# EAGLE design ms1 (EAGLE 6.5.0)

## Sheet 1 of 2: Power
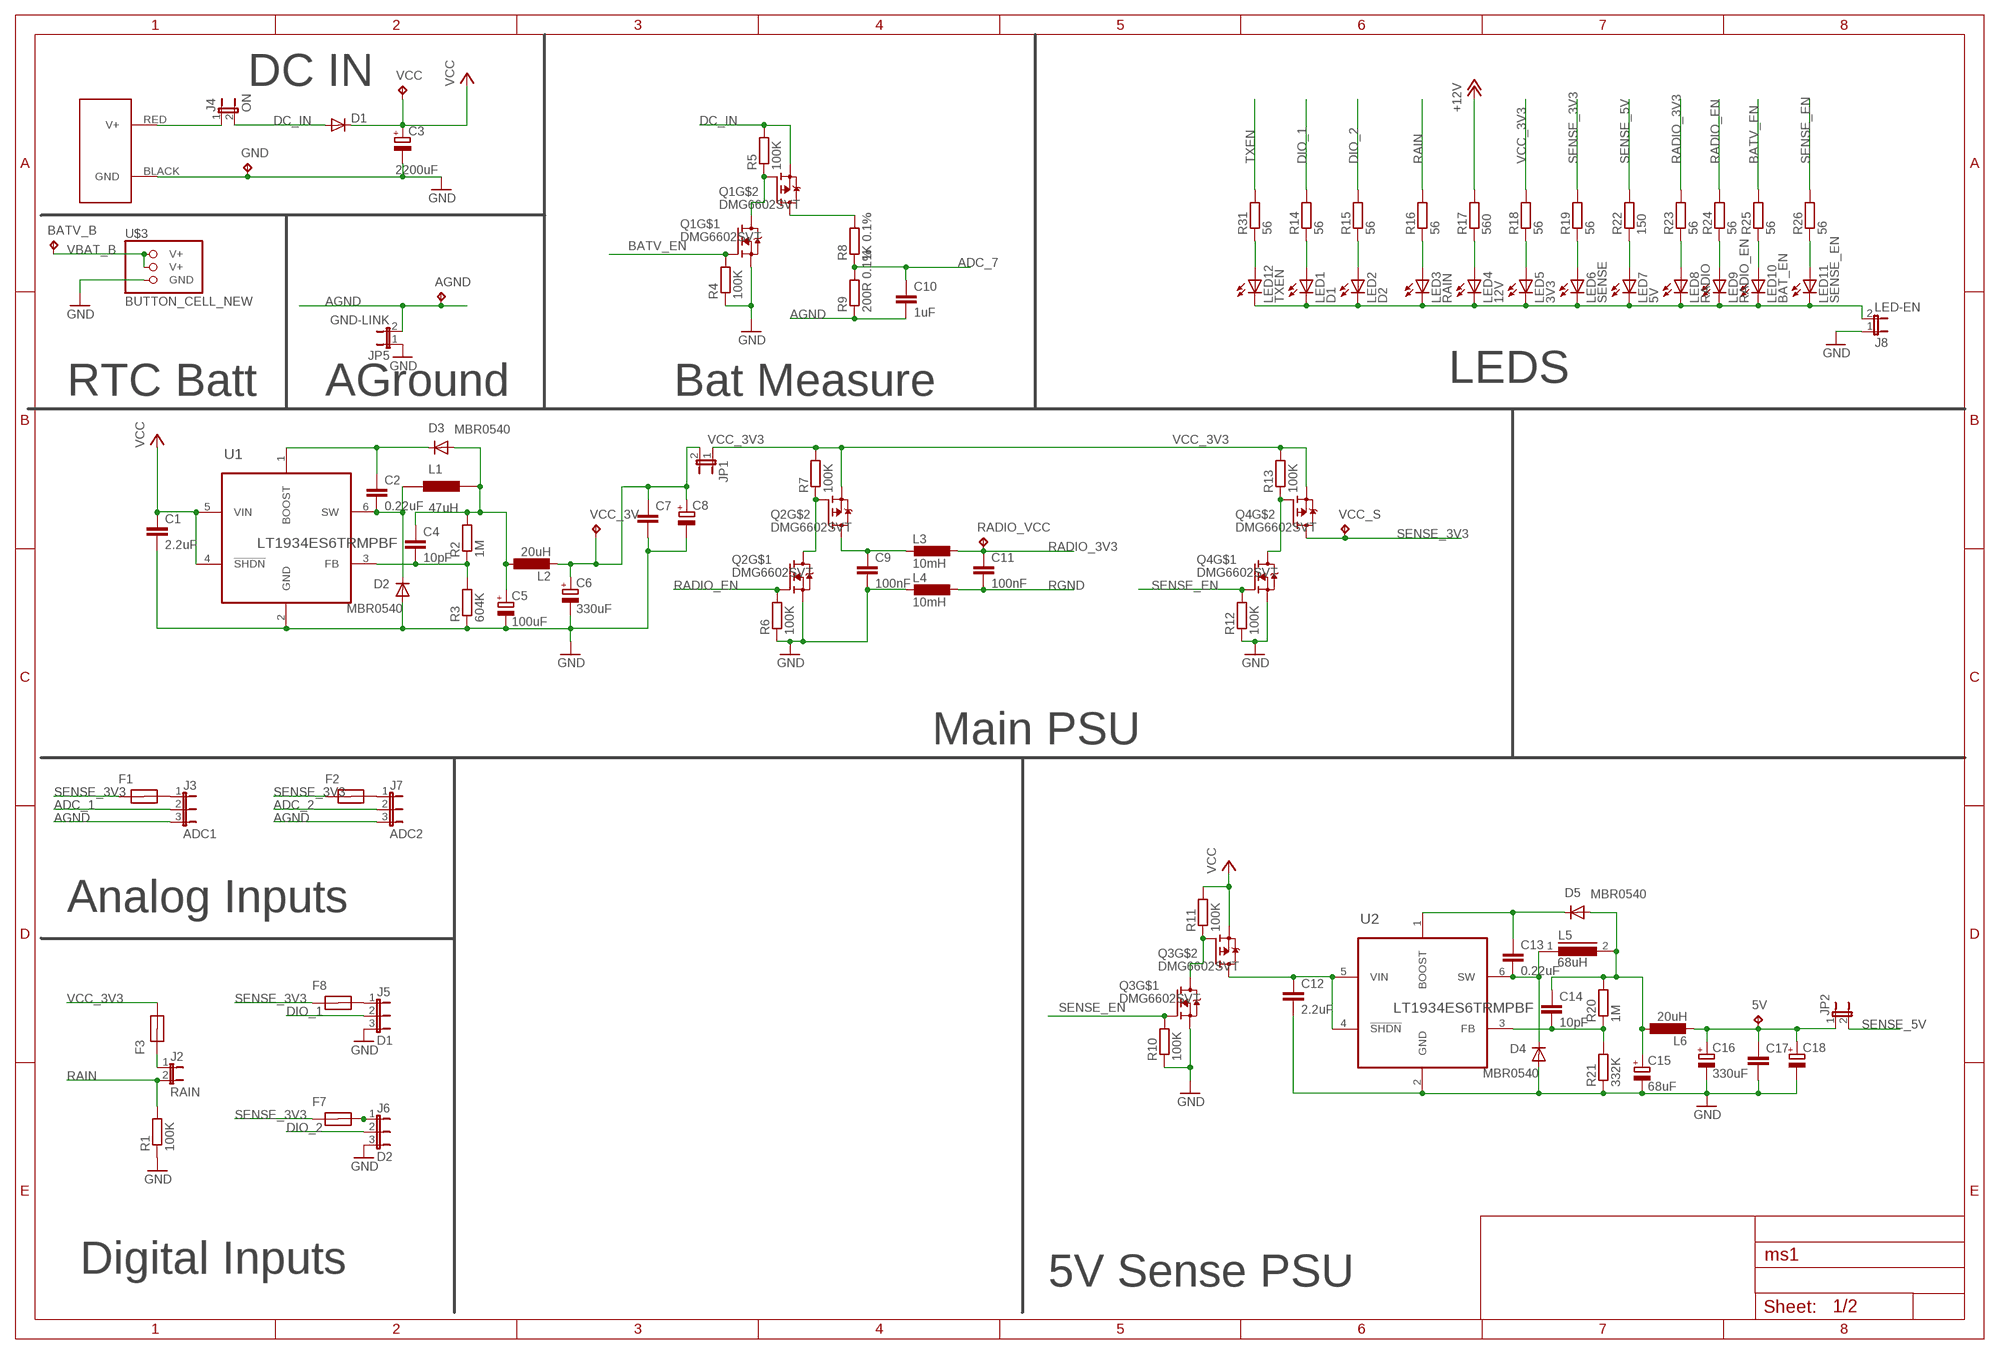
[diagram p0: schematic, sheet 1]

### Parts
5V  5V B  TPB2,54  [B2,54]
AGND  TPB2,54  [B2,54]
BATV_B  5V B  TPB2,54  [B2,54]
C1  2.2uF  C-EUC0805  [C0805]
C2  0.22uF  C-EUC0805  [C0805]
C3  2200uF  CPOL-EUE5-13  [E5-13]
C4  10pF  C-EUC0805  [C0805]
C5  100uF  CPOL-EUE  [PANASONIC_E]
C6  330uF  CPOL-EUE5-8.5  [E5-8,5]
C7  C-EUC0805  [C0805]
C8  CPOL-EUB/3528-21R  [B/3528-21R]
C9  100nF  C-EUC0805  [C0805]
C10  1uF  C-EUC0805  [C0805]
C11  100nF  C-EUC0805  [C0805]
C12  2.2uF  C-EUC0805  [C0805]
C13  0.22uF  C-EUC0805  [C0805]
C14  10pF  C-EUC0805  [C0805]
C15  68uF  CPOL-EUE  [PANASONIC_E]
C16  330uF  CPOL-EUE5-8.5  [E5-8,5]
C17  C-EUC0805  [C0805]
C18  CPOL-EUB/3528-21R  [B/3528-21R]
D1  DIODE-SMB  [SMB]
D2  MBR0540  MBR0520LT  [SOD123]
D3  MBR0540  MBR0520LT  [SOD123]
D4  MBR0540  MBR0520LT  [SOD123]
D5  MBR0540  MBR0520LT  [SOD123]
F1  MCF0805  [0805]
F2  MCF0805  [0805]
F3  MCF0805  [0805]
F7  MCF0805  [0805]
F8  MCF0805  [0805]
GND  5V B  TPB2,54  [B2,54]
J1  POWERPOLE_POWER25A  [POWERPOLE_PAIR_25A]
J2  RAIN  2-PIN-MOLEX  [2-MOLEX]
J3  ADC1  3-PIN-MOLEX  [3-MOLEX]
J4  ON  2-PIN-MOLEX  [2-MOLEX]
J5  D1  3-PIN-MOLEX  [3-MOLEX]
J6  D2  3-PIN-MOLEX  [3-MOLEX]
J7  ADC2  3-PIN-MOLEX  [3-MOLEX]
J8  LED-EN  2-PIN-MOLEX  [2-MOLEX]
JP1  JUMPER-2SMD-NO  [SJ_2S-NO]
JP2  JUMPER-2SMD-NO  [SJ_2S-NO]
JP5  GND-LINK  JP1E  [JP1]
L1  47uH  SRU1048  [1048]
L2  20uH  L-EU6000-XXX-RC  [6000-XXXX-RC]
L3  10mH  L-EUL3230M  [L3230M]
L4  10mH  L-EUL3230M  [L3230M]
L5  68uH  DR127  [DR127]
L6  20uH  L-EU6000-XXX-RC  [6000-XXXX-RC]
LED1  D1  LEDCHIP-LED0805  [CHIP-LED0805]
LED2  D2  LEDCHIP-LED0805  [CHIP-LED0805]
LED3  RAIN  LEDCHIP-LED0805  [CHIP-LED0805]
LED4  12V  LEDCHIP-LED0805  [CHIP-LED0805]
LED5  3V3  LEDCHIP-LED0805  [CHIP-LED0805]
LED6  SENSE  LEDCHIP-LED0805  [CHIP-LED0805]
LED7  5V  LEDCHIP-LED0805  [CHIP-LED0805]
LED8  RADIO  LEDCHIP-LED0805  [CHIP-LED0805]
LED9  RADIO_EN  LEDCHIP-LED0805  [CHIP-LED0805]
LED10  BAT_EN  LEDCHIP-LED0805  [CHIP-LED0805]
LED11  SENSE_EN  LEDCHIP-LED0805  [CHIP-LED0805]
LED12  TXEN  LEDCHIP-LED0805  [CHIP-LED0805]
Q1  DMG6602SVT  [TSOT26]
Q2  DMG6602SVT  [TSOT26]
Q3  DMG6602SVT  [TSOT26]
Q4  DMG6602SVT  [TSOT26]
R1  100K  R-EU_R0805  [R0805]
R2  1M  R-EU_R0805  [R0805]
R3  604K  R-EU_R0805  [R0805]
R4  100K  R-EU_R0805  [R0805]
R5  100K  R-EU_R0805  [R0805]
R6  100K  R-EU_R0805  [R0805]
R7  100K  R-EU_R0805  [R0805]
R8  1K 0.1%  R-EU_R0805  [R0805]
R9  200R 0.1%  R-EU_R0805  [R0805]
R10  100K  R-EU_R0805  [R0805]
R11  100K  R-EU_R0805  [R0805]
R12  100K  R-EU_R0805  [R0805]
R13  100K  R-EU_R0805  [R0805]
R14  56  R-EU_R0805  [R0805]
R15  56  R-EU_R0805  [R0805]
R16  56  R-EU_R0805  [R0805]
R17  560  R-EU_R0805  [R0805]
R18  56  R-EU_R0805  [R0805]
R19  56  R-EU_R0805  [R0805]
R20  1M  R-EU_R0805  [R0805]
R21  332K  R-EU_R0805  [R0805]
R22  150  R-EU_R0805  [R0805]
R23  56  R-EU_R0805  [R0805]
R24  56  R-EU_R0805  [R0805]
R25  56  R-EU_R0805  [R0805]
R26  56  R-EU_R0805  [R0805]
R31  56  R-EU_R0805  [R0805]
RADIO_VCC  TPB2,54  [B2,54]
U1  LT1934ES6TRMPBF  [SOT95P280X100-6N]
U2  LT1934ES6TRMPBF  [SOT95P280X100-6N]
U$3  BUTTON_CELL_NEW  [CR2016]
VCC  TPB2,54  [B2,54]
VCC_3V  TPB2,54  [B2,54]
VCC_S  TPB2,54  [B2,54]

### Nets
ADC_1: J3.2 ; also sheet 2
ADC_2: J7.2 ; also sheet 2
ADC_7: C10.1 R8.1 R9.2 ; also sheet 2
AGND: AGND.TP C10.2 J3.3 J7.3 JP5.2 R9.1 ; also sheet 2
BATV_EN: Q1.P$1(G) R4.2 R25.2 ; also sheet 2
DC_IN: D1.A J4.2 Q1.P$2(S) R5.2
DIO_1: J5.2 R14.2 ; also sheet 2
DIO_2: J6.2 R15.2 ; also sheet 2
GND: C1.2 C3.- C5.- C6.- C7.2 C8.- C9.2 C12.2 C15.- C16.- C17.2 C18.- D2.A D4.A GND.TP J1.BLACK(GND) J5.3 J6.3 J8.1 JP5.1 L4.2 Q1.P$5(S) Q2.P$5(S) Q3.P$5(S) Q4.P$5(S) R1.1 R3.1 R4.1 R6.1 R10.1 R12.1 R21.1 U1.2(GND) U2.2(GND) U$3.GND ; also sheet 2
LGND: J8.2 LED1.C LED2.C LED3.C LED4.C LED5.C LED6.C LED7.C LED8.C LED9.C LED10.C LED11.C LED12.C
N$1: J1.RED(V+) J4.1
N$2: LED4.A R17.1
N$3: C13.2 D4.C L5.1 U2.6(SW)
N$4: C13.1 D5.C U2.1(BOOST)
N$5: C14.2 R20.1 R21.2 U2.3(FB)
N$6: C14.1 C15.+ D5.A L5.2 L6.1 R20.2
N$7: Q2.P$3(G) Q2.P$6(D) R7.1
N$12: Q1.P$3(G) Q1.P$6(D) R5.1
N$13: C6.+ C7.1 C8.+ JP1.2 L2.2 VCC_3V.TP
N$14: 5V.TP C16.+ C17.1 C18.+ JP2.1 L6.2
N$15: LED9.A R24.1
N$16: LED3.A R16.1
N$18: F1.2 J3.1
N$19: F2.2 J7.1
N$20: LED2.A R15.1
N$21: F7.2 J6.1
N$22: F8.2 J5.1
N$23: LED1.A R14.1
N$24: C9.1 L3.2 Q2.P$4(D)
N$25: Q3.P$3(G) Q3.P$6(D) R11.1
N$26: F3.1 J2.1
N$27: LED12.A R31.1
N$50: LED10.A R25.1
N$51: LED11.A R26.1
N$70: Q4.P$3(G) Q4.P$6(D) R13.1
N$78: C2.2 D2.C L1.1 U1.6(SW)
N$107: C4.1 C5.+ D3.A L1.2 L2.1 R2.2
N$108: LED8.A R23.1
N$109: LED7.A R22.1
N$110: LED6.A R19.1
N$111: LED5.A R18.1
N$117: C2.1 D3.C U1.1(BOOST)
N$118: C4.2 R2.1 R3.2 U1.3(FB)
RADIO_3V3: C11.1 L3.1 R23.2 RADIO_VCC.TP ; also sheet 2
RADIO_EN: Q2.P$1(G) R6.2 R24.2 ; also sheet 2
RAIN: J2.2 R1.2 R16.2 ; also sheet 2
RGND: C11.2 L4.1 ; also sheet 2
SENSE_3V3: F1.1 F2.1 F7.1 F8.1 Q4.P$4(D) R19.2 VCC_S.TP ; also sheet 2
SENSE_5V: JP2.2 R22.2 ; also sheet 2
SENSE_EN: Q3.P$1(G) Q4.P$1(G) R10.2 R12.2 R26.2 ; also sheet 2
TXEN: R31.2 ; also sheet 2
VBAT_B: BATV_B.TP U$3.V+@1(V+) U$3.V+@2(V+) ; also sheet 2
VCC: C1.1 C3.+ D1.C Q3.P$2(S) R11.2 R17.2 U1.4(!SHDN) U1.5(VIN) VCC.TP ; supply symbol labelled +12V
VCC_3V3: F3.2 JP1.1 Q2.P$2(S) Q4.P$2(S) R7.2 R13.2 R18.2 ; also sheet 2
VCC_HP2_SW: C12.1 Q3.P$4(D) U2.4(!SHDN) U2.5(VIN)
VCC_HP2_SW1: Q1.P$4(D) R8.2

### Notes on the sheet
- DC IN
- RTC Batt | AGround | Bat Measure | LEDS
- Main PSU
- Analog Inputs
- Digital Inputs | 5V Sense PSU

## Sheet 2 of 2: ICs
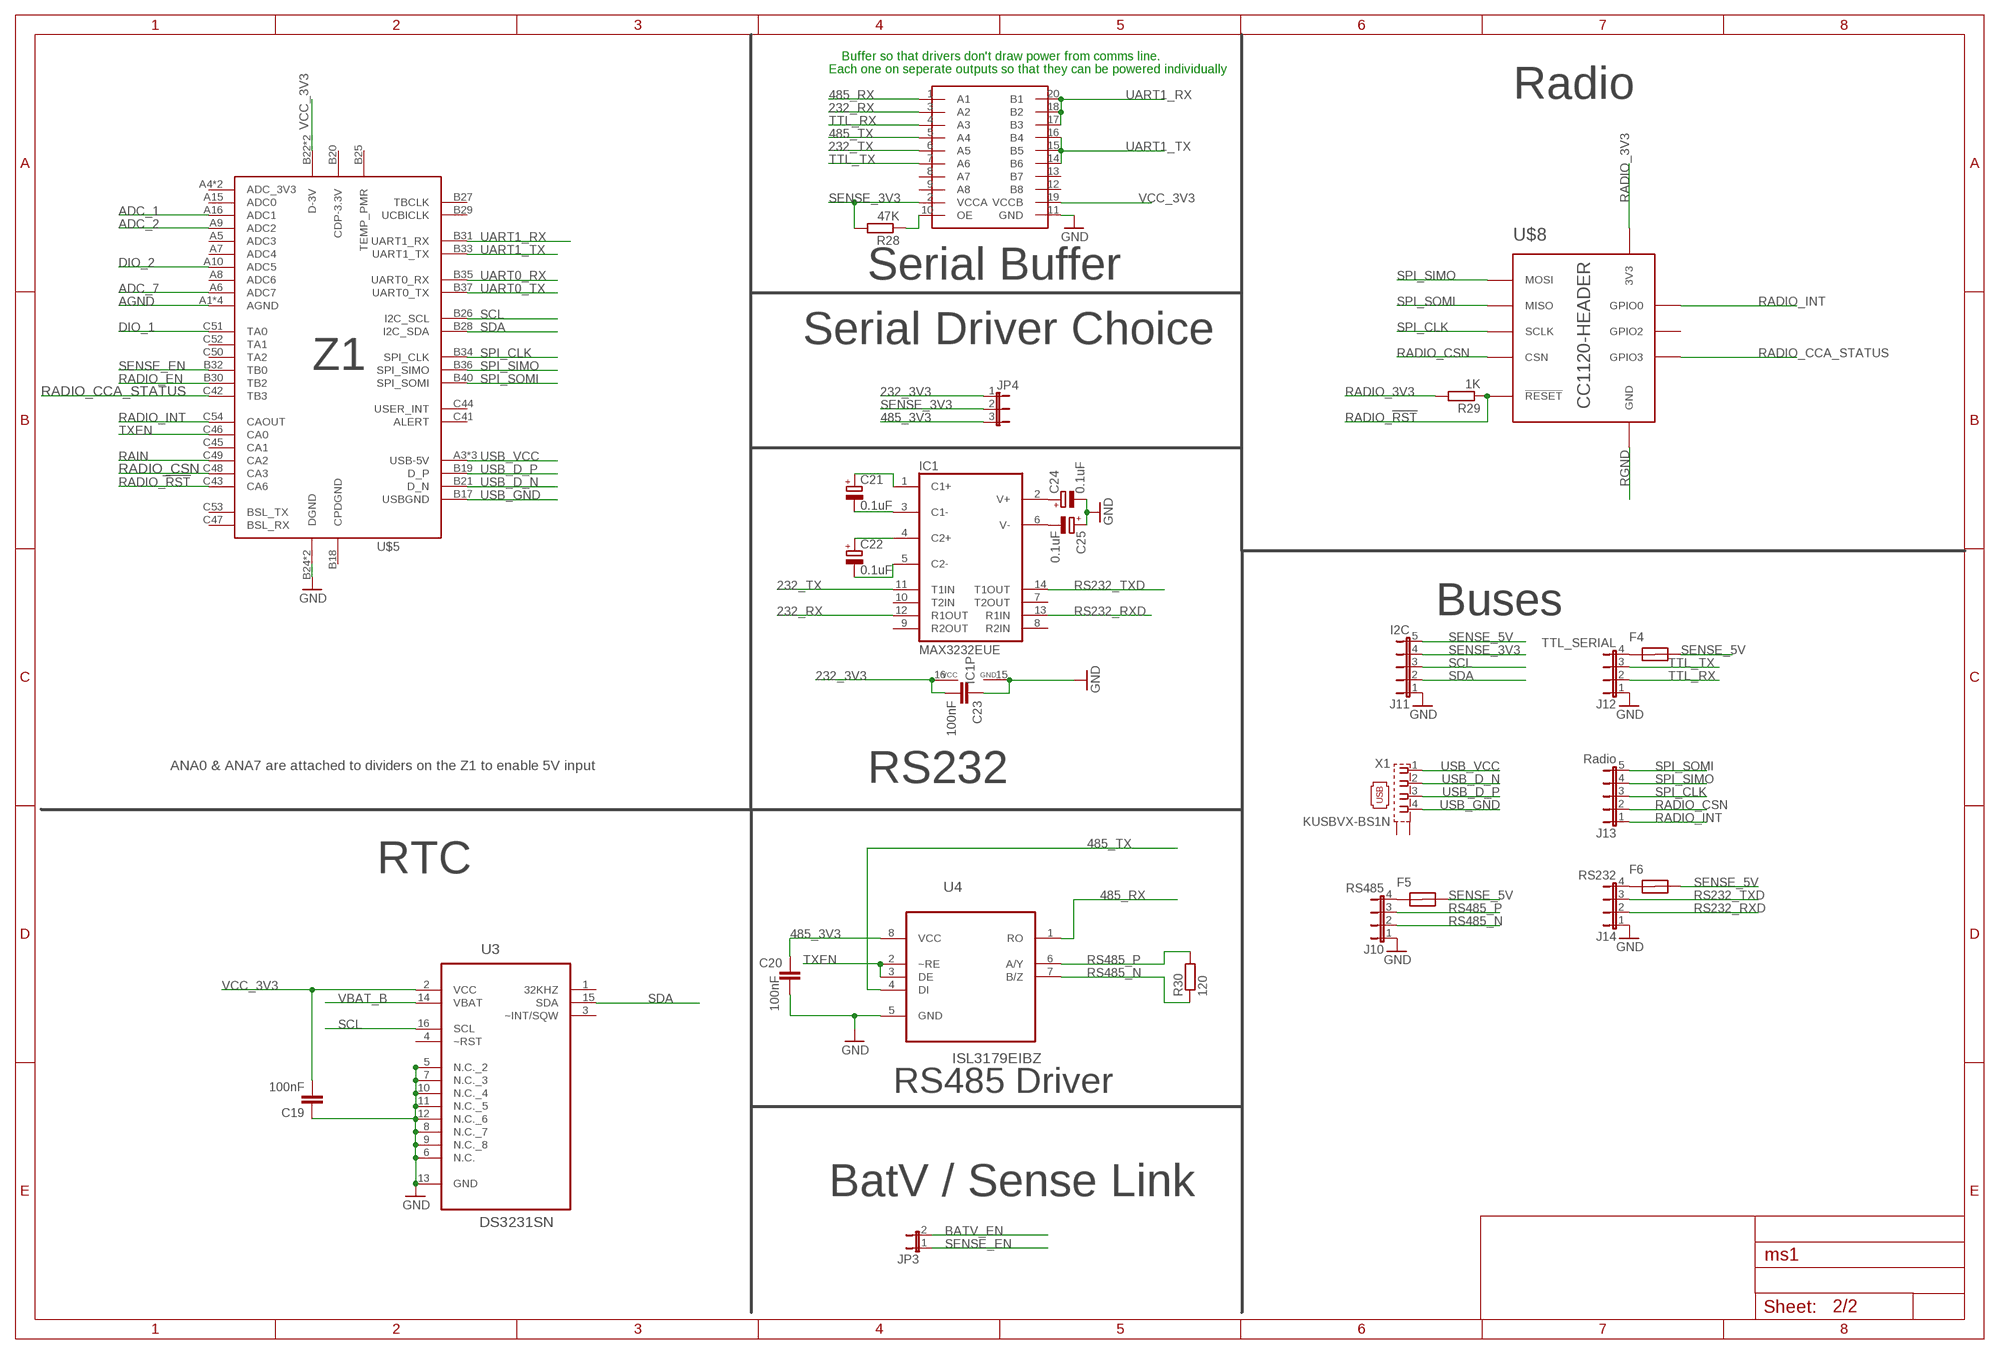
[diagram p1: schematic, sheet 2]

### Parts
C19  100nF  C-EUC0805  [C0805]
C20  100nF  C-EUC0805  [C0805]
C21  0.1uF  CPOL-EUA/3216-18W  [A/3216-18W]
C22  0.1uF  CPOL-EUA/3216-18W  [A/3216-18W]
C23  100nF  C-EUC0805  [C0805]
C24  0.1uF  CPOL-EUA/3216-18W  [A/3216-18W]
C25  0.1uF  CPOL-EUA/3216-18W  [A/3216-18W]
F4  MCF0805  [0805]
F5  MCF0805  [0805]
F6  MCF0805  [0805]
IC1  MAX3232EUE  [TSSOP16]
J10  RS485  4-PIN-MOLEX  [4-MOLEX]
J11  I2C  5-PIN-MOLEX  [5-MOLEX]
J12  TTL_SERIAL  4-PIN-MOLEX  [4-MOLEX]
J13  Radio  5-PIN-MOLEX  [5-MOLEX]
J14  RS232  4-PIN-MOLEX  [4-MOLEX]
JP3  JUMPER-2SMD-NC  [SJ_2S]
JP4  JP2E  [JP2]
R28  47K  R-EU_R0805  [R0805]
R29  1K  R-EU_R0805  [R0805]
R30  120  R-EU_R0805  [R0805]
U3  DS3231SN  [SOIC127P1032X265-16N]
U4  ISL3179EIBZ  [SOIC127P600X175-8N]
U$5  Z1  [Z1]
U$6  TXS0108E  [TSSOP20]
U$8  CC1120-HEADER-SMT  [CC1120-HEADERS-SMT]
X1  KUSBVX-BS1N  [KUSBVX-BS1N]

### Nets
232_3V3: C23.2 IC1.16(VCC) JP4.1
232_RX: IC1.12(R1OUT) U$6.3(A2)
232_TX: IC1.11(T1IN) U$6.6(A5)
485_3V3: C20.1 JP4.3 U4.8(VCC)
485_RX: U4.1(RO) U$6.1(A1)
485_TX: U4.4(DI) U$6.5(A4)
ADC_1: U$5.A16(ADC1) ; also sheet 1
ADC_2: U$5.A9(ADC2) ; also sheet 1
ADC_7: U$5.A6(ADC7) ; also sheet 1
AGND: U$5.A1(AGND) U$5.A2(AGND) U$5.A11(AGND) U$5.A12(AGND) ; also sheet 1
BATV_EN: JP3.2 ; also sheet 1
DIO_1: U$5.C51(TA0) ; also sheet 1
DIO_2: U$5.A10(ADC5) ; also sheet 1
GND: C19.1 C20.2 C23.1 C24.- C25.+ IC1.15(GND) J10.1 J11.1 J12.1 J14.1 U3.5(N.C._2) U3.6(N.C.) U3.7(N.C._3) U3.8(N.C._7) U3.9(N.C._8) U3.10(N.C._4) U3.11(N.C._5) U3.12(N.C._6) U3.13(GND) U4.5(GND) U$5.B24(DGND) U$5.C39(DGND) U$6.11(GND) ; also sheet 1
N$8: R28.1 U$6.10(OE)
N$9: F5.1 J10.4
N$11: F4.1 J12.4
N$17: F6.1 J14.4
N$59: C22.- IC1.5(C2-)
N$80: C22.+ IC1.4(C2+)
N$81: C21.- IC1.3(C1-)
N$85: C21.+ IC1.1(C1+)
N$86: C24.+ IC1.2(V+)
N$87: C25.- IC1.6(V-)
RADIO_3V3: R29.2 U$8.3V3-1(3V3) U$8.3V3-2(3V3) ; also sheet 1
RADIO_!RST: R29.1 U$5.C43(CA6) U$8.RESET(!RESET)
RADIO_CCA_STATUS: U$5.C42(TB3) U$8.GPIO3
RADIO_CSN: J13.2 U$5.C48(CA3) U$8.CSN
RADIO_EN: U$5.B30(TB2) ; also sheet 1
RADIO_INT: J13.1 U$5.C54(CAOUT) U$8.GPIO0
RAIN: U$5.C49(CA2) ; also sheet 1
RGND: U$8.GND U$8.GND1(GND) U$8.GND2(GND) ; also sheet 1
RS232_RXD: IC1.13(R1IN) J14.2
RS232_TXD: IC1.14(T1OUT) J14.3
RS485_N [rs485]: J10.2 R30.1 U4.7(B/Z)
RS485_P [rs485]: J10.3 R30.2 U4.6(A/Y)
SCL: J11.3 U3.16(SCL) U$5.B26(I2C_SCL)
SDA: J11.2 U3.15(SDA) U$5.B28(I2C_SDA)
SENSE_3V3: J11.4 JP4.2 R28.2 U$6.2(VCCA) ; also sheet 1
SENSE_5V: F4.2 F5.2 F6.2 J11.5 ; also sheet 1
SENSE_EN: JP3.1 U$5.B32(TB0) ; also sheet 1
SPI_CLK: J13.3 U$5.B34(SPI_CLK) U$8.SCLK
SPI_SIMO: J13.4 U$5.B36(SPI_SIMO) U$8.MOSI
SPI_SOMI: J13.5 U$5.B40(SPI_SOMI) U$8.MISO
TTL_RX: J12.2 U$6.4(A3)
TTL_TX: J12.3 U$6.7(A6)
TXEN: U4.2(~RE) U4.3(DE) U$5.C46(CA0) ; also sheet 1
UART0_RX: U$5.B35(UART0_RX)
UART0_TX: U$5.B37(UART0_TX)
UART1_RX: U$5.B31(UART1_RX) U$6.17(B3) U$6.18(B2) U$6.20(B1)
UART1_TX: U$5.B33(UART1_TX) U$6.14(B6) U$6.15(B5) U$6.16(B4)
USB_D_N: U$5.B21(D_N) X1.2
USB_D_P: U$5.B19(D_P) X1.3
USB_GND: U$5.B17(USBGND) X1.4
USB_VCC: U$5.A3(USB-5V) U$5.A13(USB-5V) U$5.B23(USB-5V) X1.1
VBAT_B: U3.14(VBAT) ; also sheet 1
VCC_3V3: C19.2 U3.2(VCC) U$5.B22(D-3V) U$5.C40(D-3V) U$6.19(VCCB) ; also sheet 1
Unconnected: IC1.7(T2OUT) IC1.8(R2IN) IC1.9(R2OUT) IC1.10(T2IN) U3.1(32KHZ) U3.3(~INT/SQW) U3.4(~RST) U$5.A5(ADC3) U$5.A7(ADC4) U$5.A8(ADC6) U$5.A15(ADC0) U$5.B18(CPDGND) U$5.B20(CDP-3.3V) U$5.B25(TEMP_PMR) U$5.B27(TBCLK) U$5.B29(UCBICLK) U$5.C41(ALERT) U$5.C44(USER_INT) U$5.C45(CA1) U$5.C47(BSL_RX) U$5.C50(TA2) U$5.C52(TA1) U$5.C53(BSL_TX) U$6.8(A7) U$6.9(A8) U$6.12(B8) U$6.13(B7) U$8.GPIO2 X1.M1(S1) X1.M2(S2)

### Notes on the sheet
- Buffer so that drivers don't draw power from comms line.
- Each one on seperate outputs so that they can be powered individually
- Radio
- Serial Buffer
- Serial Driver Choice
- Buses
- ANA0 & ANA7 are attached to dividers on the Z1 to enable 5V input
- RS232
- RTC
- RS485 Driver
- BatV / Sense Link

## Power pins joined to a net without a drawn wire
ADC_3V3: U$5.A4(ADC_3V3) U$5.A14(ADC_3V3)

## Library data of the parts
5V AGND BATV_B GND RADIO_VCC VCC VCC_3V VCC_S = testpad:TP: Test pad
C1 C2 C4 C7 C9-C14 C17 C19 C23 = resistor:C-EU: CAPACITOR, European symbol
C3 C5 C6 C15 C16 = rcl:CPOL-EU: POLARIZED CAPACITOR, European symbol
C8 C18 C21 C22 C24 C25 = resistor:CPOL-EU: POLARIZED CAPACITOR, European symbol
C20 = glacsweb:C-EU: CAPACITOR, European symbol
D1 = diode:DIODE-: DIODE
D2-D5 = diode:MBR0520LT: SCHOTTKY BARRIER RECTIFIER Source: http://onsemi.com .. MBR0520LT1-D.pdf
F1-F8 = farnell-parts:MCF0805
IC1 = maxim:MAX3232*: True RS-232 Transceivers 3.0V to 5.5V, Low-Power up to 1Mbps, Using Four 0.1µF External Capacitors Source: http://pdfserv.maxim-ic.com/en/ds/MAX3222-MAX3241.pdf; MF: MAXIM; MPN: MAX3232EUE+; OC_FARNELL: 1379769; OC_NEWARK: 68K4632
J1 = powerpoles:POWERPOLE_POWER: Anderson Powerpole Power Connector using ameteur radio standard layout
J2 J4 J8 = farnell-parts:2-PIN-MOLEX
J3 J5-J7 = farnell-parts:3-PIN-MOLEX
J10 J12 J14 = farnell-parts:4-PIN-MOLEX
J11 J13 = farnell-parts:5-PIN-MOLEX
JP1-JP3 = SparkFun-Passives:JUMPER-2: Jumper Basic 0.1" spaced jumper. Use with breakaway headers.
JP4 = jumper:JP2E: JUMPER
JP5 = jumper:JP1E: JUMPER
L1 = farnell-parts:SRU1048
L2 L6 = rcl:L-EU: INDUCTOR, European symbol
L3 L4 = resistor:L-EU: INDUCTOR, European symbol
L5 = inductors:DR127: High Power Density, High Efficiency, Shielded Inductors Source: coiltronics_dr_series.pdf
LED1-LED12 = led:LED: LED OSRAM: - CHIPLED LG R971, LG N971, LY N971, LG Q971, LY Q971, LO R971, LY R971 LH N974, LH R974 LS Q976, LO Q976, LY Q976 LO Q996 - Hyper CHIPLED LW Q18S LB Q993, LB Q99A, LB R99A - SideLED LS A670, LO A670, LY A670, LG A670, LP A670 LB A673, LV A673, LT A673, LW A673 LH A674 LY A675 LS A676, LA A676, LO A676, LY A676, LW A676 LS A679, LY A679, LG A679 - Hyper Micro SIDELED® LS Y876, LA Y876, LO Y876, LY Y876 LT Y87S - SmartLED LW L88C, LW L88S LB L89C, LB L89S, LG L890 LS L89K, LO L89K, LY L89K LS L896, LA L896, LO L896, LY L896 - TOPLED LS T670, LO T670, LY T670, LG T670, LP T670 LSG T670, LSP T670, LSY T670, LOP T670, LYG T670 LG T671, LOG T671, LSG T671 LB T673, LV T673, LT T673, LW T673 LH T674 LS T676, LA T676, LO T676, LY T676, LB T676, LH T676, LSB T676, LW T676 LB T67C, LV T67C, LT T67C, LS T67K, LO T67K, LY T67K, LW E67C LS E67B, LA E67B, LO E67B, LY E67B, LB E67C, LV E67C, LT E67C LW T67C LS T679, LY T679, LG T679 LS T770, LO T770, LY T770, LG T770, LP T770 LB T773, LV T773, LT T773, LW T773 LH T774 LS E675, LA E675, LY E675, LS T675 LS T776, LA T776, LO T776, LY T776, LB T776 LHGB T686 LT T68C, LB T68C - Hyper Mini TOPLED® LB M676 - Mini TOPLED Santana® LG M470 LS M47K, LO M47K, LY M47K Source: http://www.osram.convergy.de LUXEON: - LUMILED® LXK2-PW12-R00, LXK2-PW12-S00, LXK2-PW14-U00, LXK2-PW14-V00 LXK2-PM12-R00, LXK2-PM12-S00, LXK2-PM14-U00 LXK2-PE12-Q00, LXK2-PE12-R00, LXK2-PE12-S00, LXK2-PE14-T00, LXK2-PE14-U00 LXK2-PB12-K00, LXK2-PB12-L00, LXK2-PB12-M00, LXK2-PB14-N00, LXK2-PB14-P00, LXK2-PB14-Q00 LXK2-PR12-L00, LXK2-PR12-M00, LXK2-PR14-Q00, LXK2-PR14-R00 LXK2-PD12-Q00, LXK2-PD12-R00, LXK2-PD12-S00 LXK2-PH12-R00, LXK2-PH12-S00 LXK2-PL12-P00, LXK2-PL12-Q00, LXK2-PL12-R00 Source: www.luxeon.com KINGBRIGHT: KA-3528ASYC Source: www.kingbright.com
Q1-Q4 = farnell-parts:DMG6602SVT
R1-R26 R28-R31 = resistor:R-EU_: RESISTOR, European symbol
U1 U2 = farnell-parts:LT1934ES6TRMPBF; DESCRIPTION: Micropower Step-Down Switching Regulators; MPN: LT1934ES6#TRMPBF; OC_FARNELL: 1663810; OC_NEWARK: 59M8316; PACKAGE: TSOT-23-6; SUPPLIER: Linear Technology
U3 = farnell-parts:DS3231SN: Extremely Accurate I2C-Integrated RTC/TCXO/Crystal; MPN: DS3231SN#; OC_FARNELL: 1593292; OC_NEWARK: 68K3406; PACKAGE: SOIC-16; SUPPLIER: Maxim
U4 = glacsweb:ISL3179EIBZ: TRANCEIVER; MPN: ISL3179EIBZ; OC_FARNELL: 1439860; OC_NEWARK: 58M7513; PACKAGE: SOIC-8; SUPPLIER: Intersil
U$3 = gumsense:BUTTON_CELL_NEW
U$5 = z1:Z1
U$6 = basestation:TXS0108E: Texas Instruments TXS0108E 8-BIT BIDIRECTIONAL VOLTAGE-LEVEL TRANSLATOR FOR OPEN-DRAIN AND PUSH-PULL APPLICATIONS
U$8 = CC11x:CC1120-HEADER; MANUFACTURER: HARWIN; MPN: M50-3601042; OC_FARNEL: CN14037; QTY: 2
X1 = con-kycon:KUSBVX-BS1N: USB B-type Receptacle Vertical, 4 Position, Through Hole Source: Sibalco Kycon KUSBVX-BS1N-xxx.pdf

## Net classes
1 usb: width 0.305 mm, drill 0.356 mm, clearance 0.152 mm
2 rs485: width 0.305 mm, drill 0.356 mm, clearance 0.305 mm

## Board
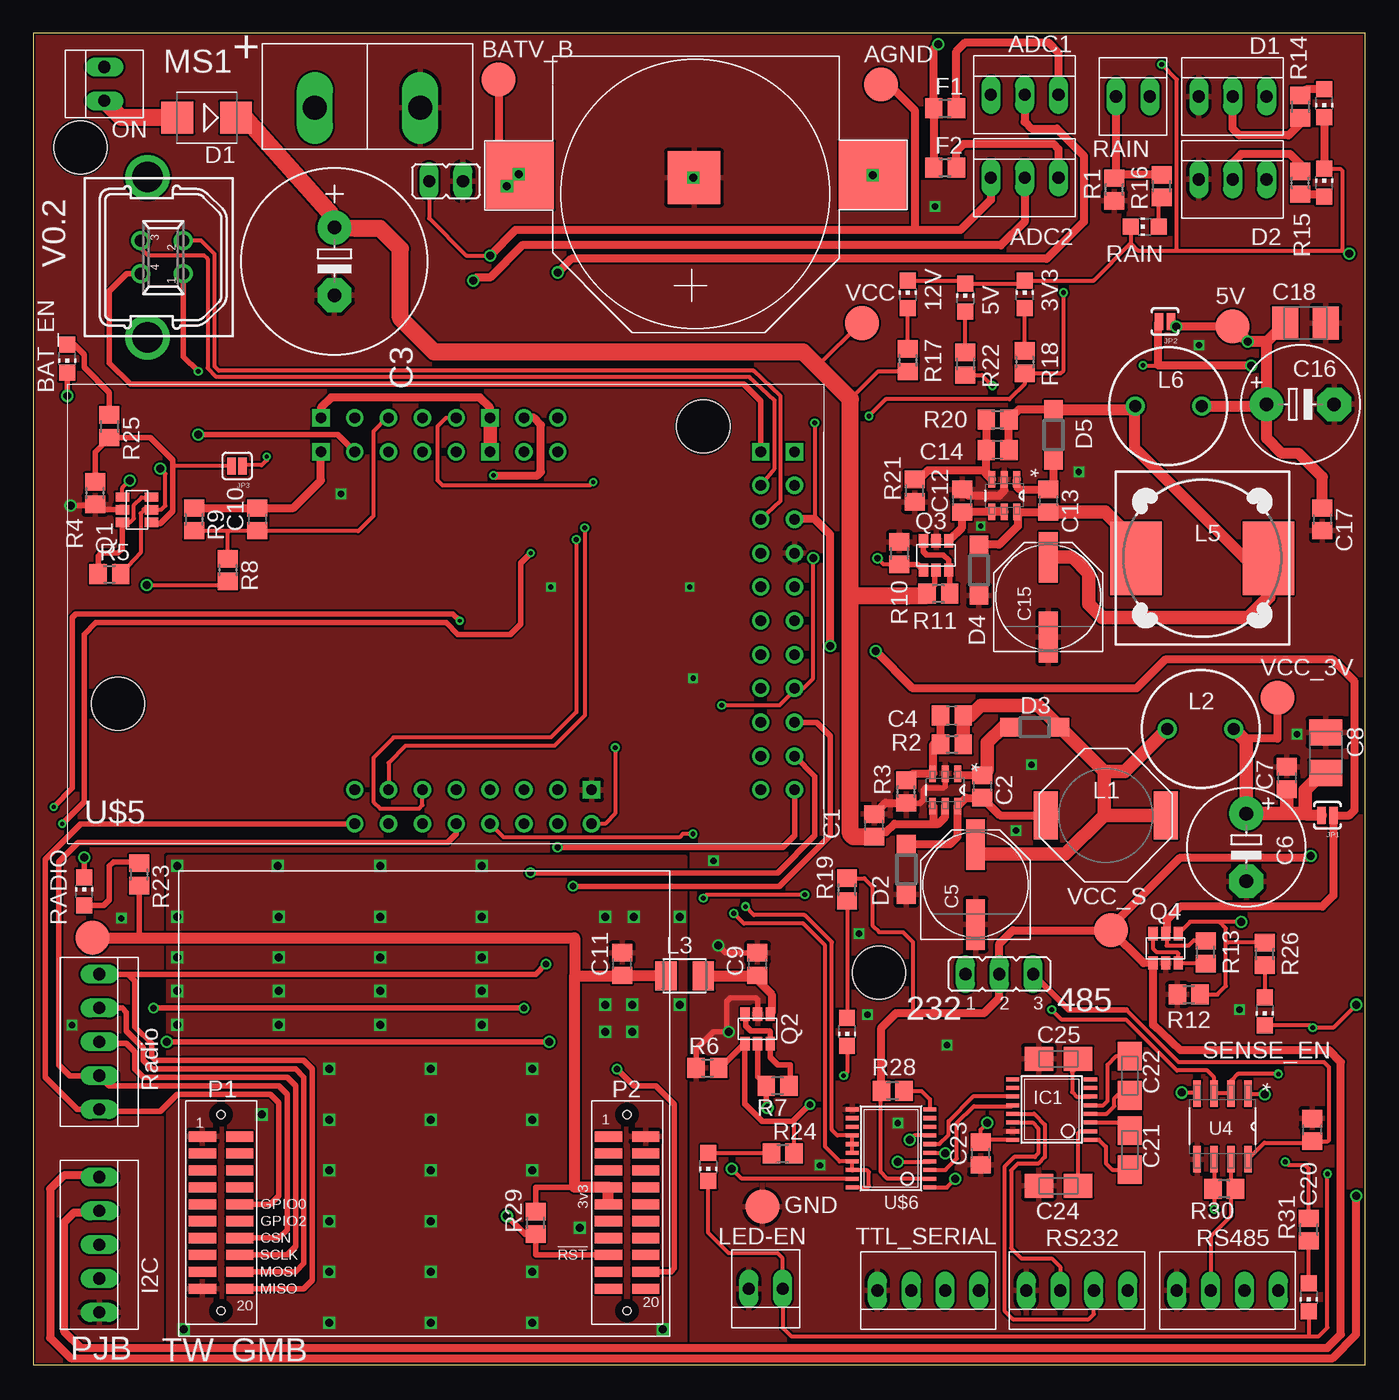
[diagram p2: board, top side]
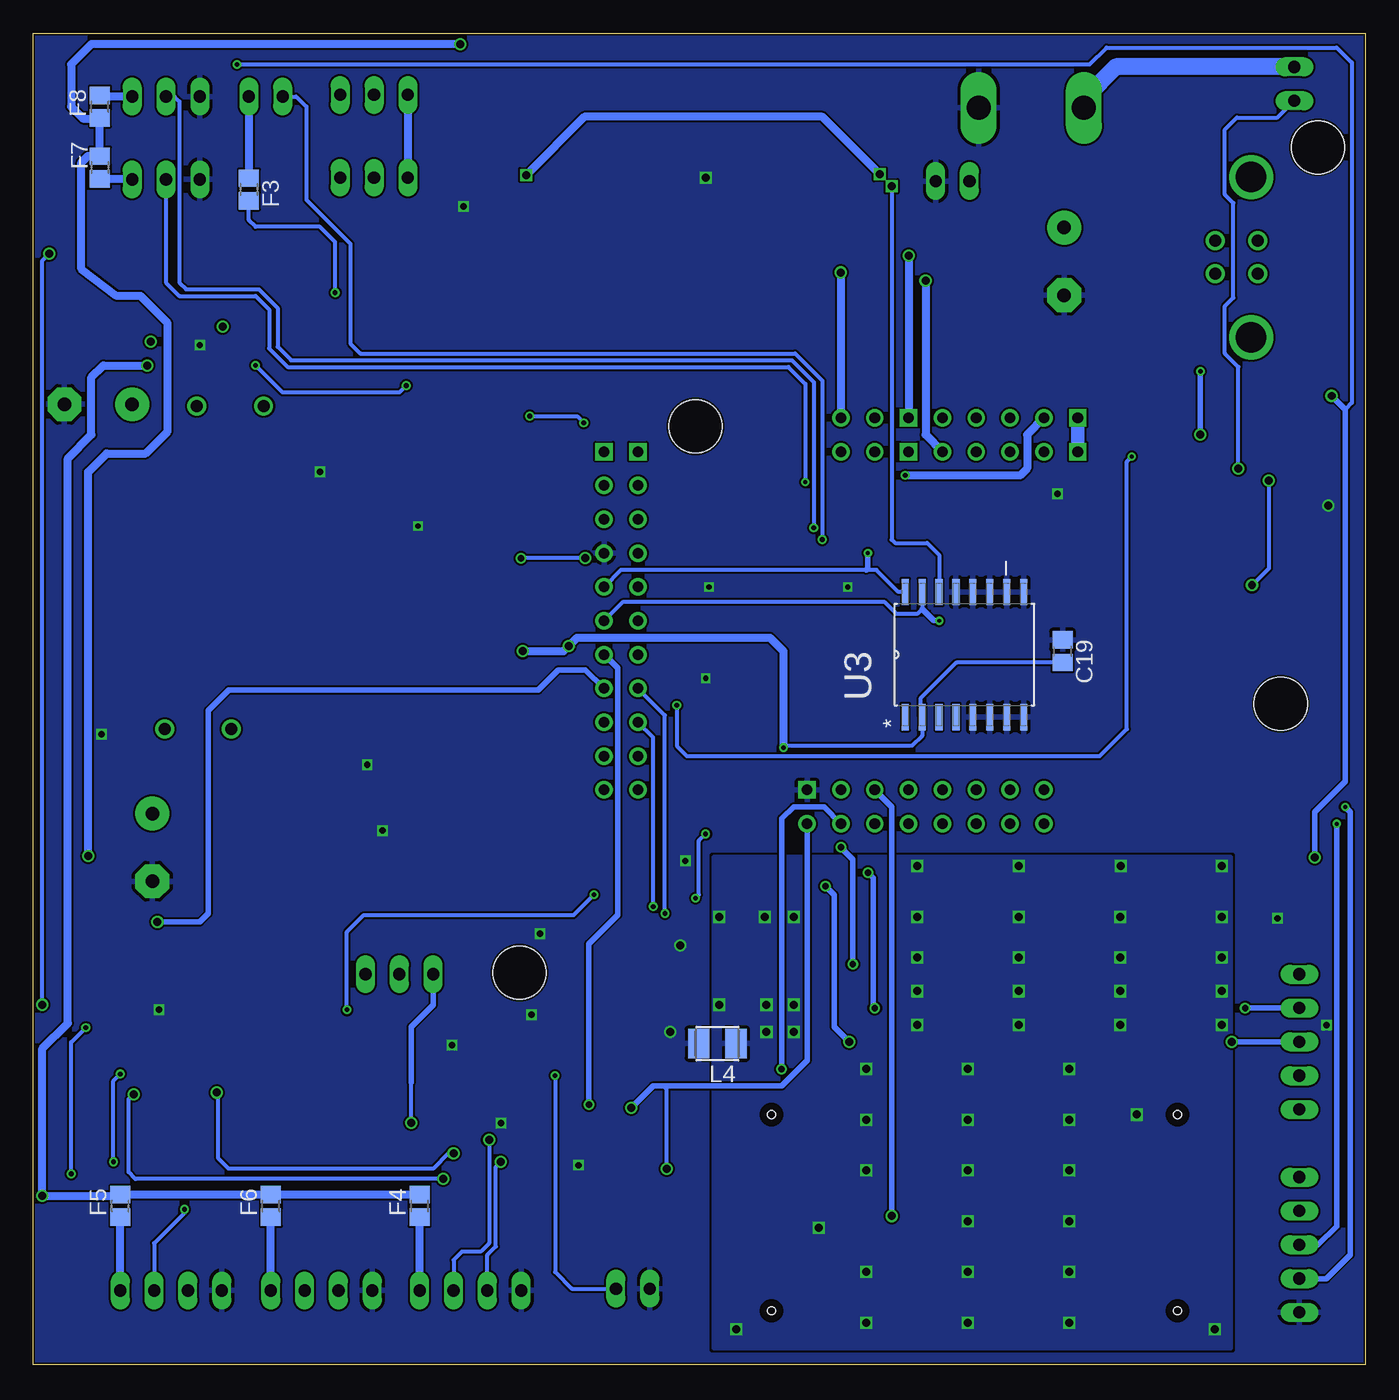
[diagram p3: board, bottom side, seen from below]

Size 100 x 100 mm. Coordinates in mm from the lower left corner, seen from the top.
Outline: 0,0 100,0 100,100 0,100 0,0
Copper layers (1*16): Top 0.035mm / dielectric 1.5mm / Bottom 0.035mm
Design rules "Hackvana *": minimum track width 6mil, minimum drill 0.3mm, track to track 6mil, track to pad 6mil, pad to pad 6mil, via to via 6mil, smd to smd 0mil, copper to edge 6mil, drill to drill 6mil, minimum pad ring 10mil, minimum via ring 6mil, stop-mask expansion 2mil, vias tented up to drill 100mil, thermal gap 10mil
Holes 4 mm at 63.5,29.46 6.35,49.66 50.29,70.48 3.56,91.44

### Footprints (pad centres in the part's own frame; a part is rotated, then mirrored left to right if it is on the bottom)
B2,54 = smd 2.54 x 2.54: TP 0,0
C0805 = smd 1.3 x 1.5: 1 -0.85,0; 2 0.85,0
E5-13 = drill 1.016 pad 2.54: + -2.54,0 | drill 1.016 pad 2.54 octagon: - 2.54,0
PANASONIC_E = smd 3.8 x 1.4: + 3,0; - -3,0
E5-8,5 = drill 1.016 pad 2.54: + -2.54,0 | drill 1.016 pad 2.54 octagon: - 2.54,0
B/3528-21R = smd 1.95 x 2.5: + 1.525,0; - -1.525,0
A/3216-18W = smd 2.15 x 1.8: + 1.475,0; - -1.475,0
SMB = smd 2.4 x 2.4: A 2.2,0; C -2.2,0
SOD123 = smd 1.4 x 1.4: A 1.9,0; C -1.9,0
0805 = smd 1.3 x 1.5: 1 -0.85,0; 2 0.85,0
TSSOP16 = smd 0.305 x 0.991: 1 -2.275,-2.918; 2 -1.625,-2.918; 3 -0.975,-2.918; 4 -0.325,-2.918; 5 0.325,-2.918; 6 0.975,-2.918; 7 1.625,-2.918; 8 2.275,-2.918; 9 2.275,2.918; 10 1.625,2.918; 11 0.975,2.918; 12 0.325,2.918; 13 -0.325,2.918; 14 -0.975,2.918; 15 -1.625,2.918; 16 -2.275,2.918
POWERPOLE_PAIR_25A = drill 1.8 long: BLACK 3.95,-0.85; RED -3.95,-0.85
2-MOLEX = drill 0.914 long: 1 -1.27,-0.381; 2 1.27,-0.381
3-MOLEX = drill 0.914 long: 1 -2.54,0; 2 0,0; 3 2.54,0
4-MOLEX = drill 0.914 long: 1 -2.667,-0.381; 2 -0.127,-0.381; 3 2.413,-0.381; 4 4.953,-0.381
5-MOLEX = drill 0.914 long: 1 -3.937,-0.127; 2 -1.397,-0.127; 3 1.143,-0.127; 4 3.683,-0.127; 5 6.223,-0.127
SJ_2S-NO = smd 0.635 x 1.27: 1 -0.45,0; 2 0.45,0
SJ_2S = smd 0.635 x 1.27: 1 -0.412,0; 2 0.412,0
JP2 = drill 0.914 long: 1 -2.54,0; 2 0,0; 3 2.54,0
JP1 = drill 0.914 long: 1 0,-1.27; 2 0,1.27
1048 = smd 1.8 x 3.6: 1 -4.5,0; 2 4.5,0
6000-XXXX-RC = drill 0.9 pad 1.422: 1 -2.5,0; 2 2.5,0
L3230M = smd 1.6 x 2.2: 1 -1.4,0; 2 1.4,0
DR127 = smd 3.85 x 5.5: 1 -4.975,0; 2 4.975,0
CHIP-LED0805 = smd 1.2 x 1.2: A 0,-1.05; C 0,1.05
TSOT26 = smd 0.7 x 1: P$1 0.4,-1.9; P$2 1.35,-1.9; P$3 2.3,-1.9; P$4 2.3,0.3; P$5 1.35,0.3; P$6 0.4,0.3
R0805 = smd 1.3 x 1.5: 1 -0.85,0; 2 0.85,0
SOT95P280X100-6N = smd 1.219 x 0.508: 1 -1.219,0.94; 2 -1.219,0; 3 -1.219,-0.94; 4 1.219,-0.94; 5 1.219,0; 6 1.219,0.94
SOIC127P1032X265-16N = smd 1.981 x 0.533: 1 -4.699,4.445; 2 -4.699,3.175; 3 -4.699,1.905; 4 -4.699,0.635; 5 -4.699,-0.635; 6 -4.699,-1.905; 7 -4.699,-3.175; 8 -4.699,-4.445; 9 4.699,-4.445; 10 4.699,-3.175; 11 4.699,-1.905; 12 4.699,-0.635; 13 4.699,0.635; 14 4.699,1.905; 15 4.699,3.175; 16 4.699,4.445
SOIC127P600X175-8N = smd 1.981 x 0.559: 1 -2.464,1.905; 2 -2.464,0.635; 3 -2.464,-0.635; 4 -2.464,-1.905; 5 2.464,-1.905; 6 2.464,-0.635; 7 2.464,0.635; 8 2.464,1.905
CR2016 = smd 3.962 x 3.962: GND -1.7,8.63 | smd 5.08 x 5.08: V+@1 -14.765,8.812; V+@2 11.7,8.83
Z1 = drill 0.8 square: A1 17.78,-5.08; A2 17.78,-2.54; A11 30.48,-5.08; A12 30.48,-2.54; B17 50.8,-5.08; B18 53.34,-5.08; C39 38.1,-30.48 | drill 0.8: A3 20.32,-5.08; A4 20.32,-2.54; A5 22.86,-5.08; A6 22.86,-2.54; A7 25.4,-5.08; A8 25.4,-2.54; A9 27.94,-5.08; A10 27.94,-2.54; A13 33.02,-5.08; A14 33.02,-2.54; A15 35.56,-5.08; A16 35.56,-2.54; B19 50.8,-7.62; B20 53.34,-7.62; B21 50.8,-10.16; B22 53.34,-10.16; B23 50.8,-12.7; B24 53.34,-12.7; B25 50.8,-15.24; B26 53.34,-15.24; B27 50.8,-17.78; B28 53.34,-17.78; B29 50.8,-20.32; B30 53.34,-20.32; B31 50.8,-22.86; B32 53.34,-22.86; B33 50.8,-25.4; B34 53.34,-25.4; B35 50.8,-27.94; B36 53.34,-27.94; B37 50.8,-30.48; B40 53.34,-30.48; C40 38.1,-33.02; C41 35.56,-30.48; C42 35.56,-33.02; C43 33.02,-30.48; C44 33.02,-33.02; C45 30.48,-30.48; C46 30.48,-33.02; C47 27.94,-30.48; C48 27.94,-33.02; C49 25.4,-30.48; C50 25.4,-33.02; C51 22.86,-30.48; C52 22.86,-33.02; C53 20.32,-30.48; C54 20.32,-33.02
TSSOP20 = smd 0.305 x 0.991: 1 -2.925,-2.918; 2 -2.275,-2.918; 3 -1.625,-2.918; 4 -0.975,-2.918; 5 -0.325,-2.918; 6 0.325,-2.918; 7 0.975,-2.918; 8 1.625,-2.918; 9 2.275,-2.918; 10 2.925,-2.918; 11 2.925,2.918; 12 2.275,2.918; 13 1.625,2.918; 14 0.975,2.918; 15 0.325,2.918; 16 -0.325,2.918; 17 -0.975,2.918; 18 -1.625,2.918; 19 -2.275,2.918; 20 -2.925,2.918
CC1120-HEADERS-SMT = smd 2.032 x 0.762: 3V3-1 13.97,1.905; 3V3-2 13.97,0.635; CSN -13.716,-1.905; GND -16.51,-5.715; GND1 -16.51,5.715; GND2 16.764,5.715; GPIO0 -13.716,0.635; GPIO2 -13.716,-0.635; GPIO3 16.764,-4.445; MISO -13.716,-5.715; MOSI -13.716,-4.445; P$2 -16.51,4.445; P$3 -16.51,3.175; P$4 -16.51,1.905; P$5 -16.51,0.635; P$6 -16.51,-0.635; P$7 -16.51,-1.905; P$8 -16.51,-3.175; P$9 -16.51,-4.445; P$11 -13.716,5.715; P$12 -13.716,4.445; P$13 -13.716,3.175; P$14 -13.716,1.905; P$21 13.97,5.715; P$22 13.97,4.445; P$23 13.97,3.175; P$26 13.97,-0.635; P$27 13.97,-1.905; P$29 13.97,-4.445; P$30 13.97,-5.715; P$32 16.764,4.445; P$33 16.764,3.175; P$34 16.764,1.905; P$35 16.764,0.635; P$36 16.764,-0.635; P$37 16.764,-1.905; P$38 16.764,-3.175; P$40 16.764,-5.715; RESET 13.97,-3.175; SCLK -13.716,-3.175 | hole 0.6: -15.113,7.366; 15.367,7.366; -15.113,-7.366; 15.367,-7.366
KUSBVX-BS1N = drill 0.9 pad 1.422: 1 1.25,2.7; 2 -1.25,2.7; 3 -1.25,-0.5; 4 1.25,-0.5 | drill 2.3 pad 2.7: M1 -6.02,0; M2 6.02,0

### Placement (x,y rotation side)
5V  90.04,77.98 0 top
AGND  63.63,96.14 0 top
BATV_B  34.92,96.52 0 top
C1  63.12,40.51 90 top
C2  71.25,43.43 270 top
C3  22.61,82.87 270 top
C4  68.96,48.77 180 top
C5  70.74,36.07 90 top
C6  91.06,38.86 270 top
C7  94.11,44.07 90 top
C8  97.03,45.97 270 top
C9  54.36,30.1 90 top
C10  16.83,63.5 90 top
C11  44.2,30.1 90 top
C12  69.72,64.9 90 top
C13  76.2,64.9 270 top
C14  72.39,68.71 180 top
C15  76.2,57.66 90 top
C16  95.12,72.14 0 top
C17  96.77,63.5 270 top
C18  95.5,78.23 180 top
C19  22.73,53.59 270 bottom
C20  96.01,17.65 90 top
C21  82.3,16.13 270 top
C22  82.3,21.72 270 top
C23  71.12,15.88 90 top
C24  76.96,13.46 0 top
C25  76.96,22.99 180 top
D1  13.02,93.66 180 top
D2  65.53,37.21 270 top
D3  75.18,47.88 0 top
D4  70.99,59.69 270 top
D5  76.58,69.85 90 top
F1  68.45,94.36 0 top
F2  68.45,89.92 0 top
F3  83.82,88.27 270 bottom
F4  70.99,11.94 90 bottom
F5  93.47,11.94 90 bottom
F6  82.17,11.94 90 bottom
F7  95,89.92 270 bottom
F8  95,94.49 90 bottom
GND  54.74,11.87 0 top
IC1  76.45,19.18 90 top
J1  25.08,95.25 0 top
J2  82.55,94.87 180 top
J3  74.42,95.38 180 top
J4  5.71,96.2 270 top
J5  90.04,95.25 180 top
J6  90.04,89.03 180 top
J7  74.42,89.15 180 top
J8  54.99,6.1 0 top
J10  88.52,5.97 0 top
J11  4.83,7.87 90 top
J12  66.04,5.97 0 top
J13  4.83,23.11 90 top
J14  77.22,5.97 0 top
JP1  97.16,41.27 180 top
JP2  84.96,78.36 180 top
JP3  15.3,67.5 180 top
JP4  72.52,29.34 0 top
JP5  30.99,88.9 90 top
L1  80.52,41.27 0 top
L2  87.63,47.75 0 top
L3  48.9,29.21 0 top
L4  48.64,24.13 180 bottom
L5  87.76,60.58 0 top
L6  85.22,72.01 0 top
LED1  96.9,94.74 180 top
LED2  96.9,88.77 0 top
LED3  83.44,85.47 90 top
LED4  65.66,80.39 0 top
LED5  74.42,80.39 0 top
LED6  61.09,25.02 180 top
LED7  69.98,80.14 0 top
LED8  3.81,35.56 0 top
LED9  50.67,14.86 180 top
LED10  2.54,75.56 180 top
LED11  92.46,26.54 180 top
LED12  95.76,5.08 180 top
Q1  6.99,62.87 90 top
Q2  53.02,26.04 0 top
Q3  66.42,61.59 0 top
Q4  86.36,30.48 180 top
R1  81.15,88.27 90 top
R2  68.96,46.61 0 top
R3  65.53,43.05 90 top
R4  4.64,65.47 90 top
R5  5.71,59.37 0 top
R6  50.61,22.29 0 top
R7  55.88,20.95 180 top
R8  14.61,59.69 270 top
R9  12.06,63.5 270 top
R10  65.02,60.96 270 top
R11  67.94,57.91 180 top
R12  86.74,27.81 0 top
R13  88.01,30.99 90 top
R14  95.12,94.49 270 top
R15  95.12,88.77 90 top
R16  84.71,88.52 90 top
R17  65.66,75.44 270 top
R18  74.42,75.31 270 top
R19  61.09,35.69 90 top
R20  72.39,70.99 0 top
R21  66.17,65.66 90 top
R22  69.98,75.18 270 top
R23  7.94,36.83 270 top
R24  56.26,15.88 0 top
R25  5.71,70.48 270 top
R26  92.46,30.86 90 top
R28  64.52,20.57 180 top
R29  37.72,10.67 90 top
R30  89.41,13.21 180 top
R31  95.76,10.16 90 top
RADIO_VCC  4.45,32.07 0 top
U1  68.45,43.18 270 top
U2  72.9,65.28 270 top
U3  30.1,53.34 90 bottom
U4  89.28,17.91 270 top
U$3  51.31,80.52 0 top
U$5  3.81,73.66 0 top
U$6  64.39,16.26 90 top
U$8  29.21,11.43 0 top
VCC  62.23,78.23 0 top
VCC_3V  93.4,50.09 0 top
VCC_S  80.9,32.64 0 top
X1  8.57,83.19 270 top

### Tracks (layer width: path | path; a pad name or v marks a point on that pad's centre or on a via)
232_3V3  (via drill 0.6)
  Top 0.305: IC1.16 71.81,16.9 C23.2 71.12,17.65 v71.63,18.16
  Bottom 0.305: v71.63,18.16 71.63,21.21
  Bottom 0.406: 71.63,21.21 71.63,25.4 69.98,27.05 JP4.1
232_RX
  Top 0.305: U$6.3 68.48,14.63 69.34,15.49 69.34,18.16 70.61,19.43 73.47,19.43 IC1.12
232_TX
  Top 0.305: U$6.6 68.02,16.58 68.71,17.27 68.71,18.29 70.61,20.19 73.5,20.19 IC1.11
485_3V3
  Top 0.305: U4.8 92.42,16.68 95.89,16.68 C20.1 97.19,16.8 97.28,16.89 97.28,22.35 96.9,22.73 85.98,22.73 82.04,26.67
  Top 0.406: 82.04,26.67 77.72,26.67 JP4.3
485_RX  (via drill 0.6)
  Top 0.305: U$6.1 68.58,13.33 v69.22,13.97 | v92.46,20.32 91.24,20.32 U4.1
  Bottom 0.305: v69.22,13.97 92.33,13.97 92.84,14.48 92.84,19.94 v92.46,20.32
485_TX  (via drill 0.6)
  Top 0.305: U$6.5 68.4,15.93 v68.45,15.88 | v86.23,20.45 87.3,20.45 U4.4
  Bottom 0.305: v68.45,15.88 68.83,15.88 69.98,14.73 85.34,14.73 86.11,15.49 86.11,20.32 v86.23,20.45
ADC_1  (via drill 0.6)
  Top 0.61: J3.2 74.42,93.34 74.93,92.84 76.83,92.84 78.87,90.81 78.87,85.85 76.07,83.06 40.39,83.06 v39.37,82.04
  Bottom 0.61: v39.37,82.04 U$5.A16
ADC_2  (via drill 0.6)
  Top 0.61: J7.2 74.42,85.85 72.64,84.07 36.7,84.07 34.29,81.66 33.27,81.66 v33.02,81.41
  Bottom 0.61: v33.02,81.41 33.02,69.85 U$5.A9
ADC_3V3  (via drill 0.36)
  Top 0.61: v34.54,66.8 37.85,66.8 38.1,67.06 38.1,70.61 37.59,71.12 U$5.A14
  Bottom 0.61: U$5.A4 25.4,69.85 25.4,67.31 25.91,66.8 v34.54,66.8
ADC_7
  Top 0.305: R9.2 14.48,62.65 | 14.48,62.65 C10.1 16.87,62.61 24.38,62.61 25.53,63.75 25.53,70.1 26.54,71.12 U$5.A6 | R8.1 14.61,62.52 14.48,62.65
AGND  (via drill 0.6)
  Top 0.305: JP5.2 29.72,86.11 32.51,83.31 v34.29,83.31
  Top 0.61: J7.3 71.88,87.5 69.6,85.22 66.17,85.22 | 66.17,85.22 36.2,85.22 v34.29,83.31 | R9.1 C10.2 19.52,64.35 21.59,66.42 U$5.A1 | AGND.TP 64.26,96.14 66.17,94.23 66.17,85.22 | U$5.A12 34.29,71.88 33.53,72.64 22.35,72.64 21.59,71.88 U$5.A2
  Top 1.016: U$5.A12 U$5.A11
  Bottom 0.61: J3.3 J7.3 | v34.29,83.31 U$5.A12 | U$5.A2 21.34,71.12
  Bottom 1.016: U$5.A2 U$5.A1
BATV_EN
  Top 0.305: JP3.2 10.54,67.5 10.48,67.56
  Top 0.406: Q1.P$1 8.97,63.18 9.53,63.18 10.48,64.14 10.48,67.56 10.48,67.94 8.79,69.64 R25.2 4.64,68.56 R4.2
DC_IN  (via drill 0.6)
  Top 0.305: 8.34,64.22 8.06,63.94 8.06,61 R5.2 | Q1.P$2 9.61,64.22 9.91,64.52 9.91,66.93 v9.53,67.31
  Top 0.406: Q1.P$2 8.34,64.22
  Top 1.27: D1.A 6.6,93.66 J4.2
  Bottom 0.305: v9.53,67.31 9.53,74.93 10.54,75.95 10.54,79.5 9.91,80.14 9.91,87.25 10.54,87.88 10.54,92.77 9.65,93.66 6.6,93.66 J4.2
DIO_1  (via drill 0.36)
  Top 0.305: v41.4,62.87 41.4,48.77 39.12,46.48 27.94,46.48 26.67,45.21 U$5.C51
  Top 0.61: R14.2 95.12,93.22 94.23,92.33 90.55,92.33 90.04,92.84 J5.2
  Bottom 0.305: v41.4,62.87 41.4,73.79 43.05,75.44 80.64,75.44 81.66,76.45 81.66,79.38 83.06,80.77 88.52,80.77 89.03,81.28 89.03,94.87 89.41,95.25 J5.2
DIO_2  (via drill 0.3)
  Top 0.305: v42.04,66.29 41.78,66.04 30.73,66.04 30.35,66.42 30.35,70.48 30.99,71.12 U$5.A10
  Top 0.61: R15.2 95.12,90.17 94.36,90.93 90.68,90.93 90.04,90.3 J6.2
  Bottom 0.305: J6.2 90.04,81.28 89.03,80.26 83.31,80.26 82.3,79.25 82.3,76.33 80.9,74.93 43.31,74.93 42.04,73.66 v42.04,66.29
GND  (via drill 0.38, 0.48, 0.6)
  Top 0.406: v2.79,64.52 4.53,64.52 R4.1 5.04,64.22 Q1.P$5 | Q2.P$5 54.37,27.42 54.23,27.56 52.32,27.56 52.07,27.3 52.07,25.15 v52.2,25.02 51.05,25.02 49.76,23.72 R6.1 | C9.2 51.98,30.95 v51.44,31.5 | v49.53,89.15 U$3.GND | R3.1 65.57,42.16 66.55,42.16 66.8,42.42 66.8,43.18 66.93,43.31 68.33,43.31 68.45,43.43 U1.2
  Top 0.61: C1.2 63.96,42.2 R3.1 | C12.2 70.19,65.28 72.52,65.28 72.9,65.66 U2.2
  other vias: 74.93,45.09 73.79,40.13 78.49,67.06 71.12,62.99 94.87,47.37 90.55,26.67 68.58,24 62.61,26.29 59.05,14.99 23.11,65.41 51.05,37.85 2.92,25.53 6.6,33.53 64.9,18.16 61.98,32.38 87.5,76.58 67.69,87 38.86,58.42 49.28,58.42 49.53,51.56
  pour Bottom (rank 2): -1.91,104.78 103.76,105.03 103.76,-5.46 -1.91,-5.71
  pour Top (rank 3): 0,103.5 101.98,103.25 101.98,-3.43 0,-3.17
LGND  (via drill 0.36, 0.6)
  Top 0.305: LED3.C 82.39,84.23 | 82.39,84.23 82.93,83.69 85.85,83.69 | 85.85,83.69 98.3,83.69 | 98.3,83.69 98.3,89.66 98.17,89.79 96.94,89.79 LED2.C | v98.81,83.44 98.55,83.44 98.3,83.69 | 85.85,83.69 85.85,96.52 v84.71,97.66 | LED4.C 69.72,81.44 LED7.C 74.17,81.19 LED5.C 79.59,81.44 82.39,84.23 | LED9.C 50.67,9.91 52.2,8.38 55.88,8.38 56.26,8 J8.2 56.26,2.79 56.9,2.16 95.76,2.16 | 95.76,2.16 96.52,2.16 97.16,2.79 v97.16,14.35 | LED11.C 95.89,25.49 v96.06,25.32 97.58,25.32 v99.31,27.05 | LED6.C 61.09,21.97 v60.83,21.72 | LED12.C 95.76,2.16
  Top 0.406: LED8.C v3.81,38.1 | v2.54,72.77 LED10.C
  Top 0.61: LED1.C LED2.C
  Bottom 0.305: v99.31,27.05 99.31,82.93 v98.81,83.44 | v84.71,97.66 20.7,97.66 19.43,98.93 2.16,98.93 1.02,97.79 1.02,72.26 1.52,71.75 | v97.16,14.35 97.16,24.22 v96.06,25.32 95.89,25.49 | v60.83,21.72 60.83,6.99 59.56,5.71 J8.2
  Bottom 0.406: v3.81,38.1 3.81,41.53 1.52,43.81 1.52,71.75 v2.54,72.77
N$1
  Bottom 1.27: J4.1 18.73,97.47 20.95,95.25 20.95,94.58 J1.RED
N$2
  Top 0.305: R17.1 LED4.A
N$3
  Top 0.61: C13.2 73.85,64.05 U2.6 73.91,63.98 73.91,62.99 72.51,61.59 D4.C
  Top 1.016: C13.2 80.48,64.05 82.8,61.72 82.8,60.6 L5.1
N$4
  Top 0.61: U2.1 73.84,65.96 74.06,65.75 C13.1 76.58,66.13 D5.C
N$5
  Top 0.61: R20.1 C14.2 71.54,67.44 | U2.3 71.54,66.92 71.54,67.44 | R21.2 66.51,66.51 67.18,67.18 71.29,67.18 71.54,67.44
N$6
  Top 0.61: C14.1 R20.2 74,71.75 D5.A
  Top 0.813: 92.46,60.58 90.93,60.58 82.68,68.83 82.68,71.97 L6.1 82.46,71.75 D5.A
  Top 1.016: 92.46,60.58 L5.2 92.73,57.66 91.21,56.13 80.26,56.13 79.25,57.15 79.25,59.44 78.03,60.66 C15.+
N$7
  Top 0.406: Q2.P$6 53.47,26.29 53.47,25.46 53.85,25.08 55.24,25.08 55.32,25 Q2.P$3 55.32,23.1 55.88,22.54 56.83,22.54 56.83,21.06 R7.1
N$8
  Top 0.305: R28.1 66.67,20.57 67.31,19.94 U$6.10
N$9
  Bottom 0.61: J10.4 F5.1
N$11
  Bottom 0.61: J12.4 F4.1
N$12
  Top 0.305: Q1.P$6 7.26,63.27 7.56,63.56 7.56,64.58 8.13,65.15 8.87,65.15
  Top 0.406: R5.1 4.87,60.74 5.08,60.96 6.35,60.96 6.67,61.28 6.67,63.25 Q1.P$6 | 8.87,65.15 Q1.P$3
N$13
  Top 0.61: 91.06,46.82 90.85,47.03 93.39,47.03 VCC_3V.TP
  Top 0.813: JP1.2 95.63,41.27 95.5,41.4
  Top 1.016: L2.2 90.85,47.03 | 91.06,46.82 C6.+ 94.11,41.4 | 94.11,41.4 95.5,41.4 95.5,43.18 96.77,44.45 C8.+ | C7.1 94.11,41.4
N$14  (via drill 0.6)
  Top 0.61: 5V.TP v85.79,77.98 JP2.1
  Top 0.813: L6.2 92.46,72.01 C16.+ | C16.+ 92.58,76.84 | 92.58,76.84 C18.+ | C17.1 96.77,66.67 95,68.45 93.73,68.45 92.58,69.6 C16.+ | 92.58,76.84 v91.19,76.84 5V.TP
N$15
  Top 0.305: LED9.A 55.38,15.91 R24.1
N$16
  Top 0.305: LED3.A 84.49,87.45 R16.1
N$17
  Bottom 0.61: J14.4 F6.1
N$18
  Top 0.61: F1.2 69.3,98.64 69.98,99.31 76.2,99.31 76.96,98.55 J3.1
N$19
  Top 0.61: F2.2 69.3,91.15 69.85,91.69 76.58,91.69 76.96,91.31 J7.1
N$20
  Top 0.61: R15.1 96.7,87.92 LED2.A
N$21
  Bottom 0.61: J6.1 94.96,89.03 F7.2
N$22
  Bottom 0.61: J5.1 94.91,95.25 F8.2
N$23
  Top 0.61: LED1.A 95.58,95.79 R14.1
N$24
  Top 0.61: 54.36,29.21 54.36,28.89 55.44,27.81 55.44,26.45 Q2.P$4
  Top 0.813: L3.2 54.36,29.21 C9.1
N$25
  Top 0.406: Q3.P$6 66.8,61.88 66.8,61.09 67.06,60.83 68.33,60.83 68.72,60.44 Q3.P$3 68.8,59.62 R11.1
N$26
  Bottom 0.61: J2.1 F3.1
N$27
  Top 0.305: LED12.A R31.1
N$50
  Top 0.406: LED10.A 3.08,76.61 3.81,75.88 3.81,74.93 5.71,73.03 R25.1
N$51
  Top 0.305: R26.1 LED11.A
N$59
  Top 0.305: IC1.5 80.33,19.5 80.64,19.81 80.64,22.53 81.31,23.19 C22.-
N$70
  Top 0.305: R13.1 87.97,30.18 Q4.P$6 85.96,30.88 85.85,30.99 84.33,30.99 84.07,31.24 84.07,32.37 Q4.P$3
N$78
  Top 0.61: L1.1 72.56,41.27 C2.2 70.02,42.58 U1.6 69.39,39.67 68.83,39.12 D2.C
N$80
  Top 0.305: IC1.4 80.57,18.85 81.15,19.43 81.15,20.02 81.38,20.24 C22.+
N$81
  Top 0.305: IC1.3 81.7,18.2 C21.-
N$85
  Top 0.305: IC1.1 80,16.9 80.52,16.38 80.52,15.14 81,14.66 C21.+
N$86
  Top 0.305: C24.+ 78.44,17.4 78.59,17.55 IC1.2
N$87
  Top 0.305: C25.- 78.44,22.43 77.98,21.97 77.98,20.5 78.33,20.14 IC1.6
N$107
  Top 0.61: 70.36,48.77 C4.1 | C5.+ 70.69,38.35
  Top 1.016: C4.1 R2.2 | 70.36,48.77 71.12,49.53 75.43,49.53 D3.A 80.39,44.57 | 70.69,38.35 77.47,38.35 80.39,41.27 | 80.39,41.27 L1.2 | 80.39,44.57 80.39,41.27 | L2.1 81.95,44.57 80.39,44.57
N$108
  Top 0.406: LED8.A 5.3,34.51 5.71,34.92 5.71,37.47 6.03,37.78 7.83,37.78 R23.1
N$109
  Top 0.305: R22.1 LED7.A
N$110
  Top 0.305: R19.1 LED6.A
N$111
  Top 0.305: R18.1 LED5.A
N$117
  Top 0.61: U1.1 69.51,44.28 C2.1 71.63,44.66 | 72.77,47.88 D3.C
  Top 1.016: 71.63,44.66 71.63,46.74 72.77,47.88
N$118
  Top 0.61: R3.2 66.03,44.4 U1.3 67.56,44.45 67.56,46.61 R2.1 C4.2
RADIO_3V3
  Top 0.406: R23.2 7.94,32.07 | R29.2 37.72,13.34 41.15,13.34
  Top 0.813: U$8.3V3-2 U$8.3V3-1 41.15,13.34 40.64,13.34 40.64,29.21 | 40.64,29.21 44.2,29.21 C11.1 47.49,29.25 L3.1 | RADIO_VCC.TP 7.94,32.07 40.64,32.07 40.64,29.21
RADIO_!RST  (via drill 0.6)
  Top 0.406: U$8.RESET 37.72,8.26 R29.1 36.92,9.82 v35.56,11.18
  Bottom 0.406: U$5.C43 35.56,41.91 v35.56,11.18
RADIO_CCA_STATUS  (via drill 0.48)
  Top 0.406: U$8.GPIO3 47.88,6.99 48.13,7.24 48.13,19.56 46.74,20.95 45.09,20.95 v43.81,22.23
  Bottom 0.406: v43.81,22.23 43.81,41.02 42.93,41.91 40.64,41.91 U$5.C42
RADIO_CSN
  Top 0.406: U$8.CSN 18.41,9.53 19.05,10.16 19.05,20.32 18.41,20.95 5.71,20.95 J13.2 2.73,21.72 1.91,22.54 1.91,37.78 3.37,39.24 31.11,39.24 31.75,39.88 U$5.C48
RADIO_EN  (via drill 0.48)
  Top 0.305: R24.2 57.11,18.2 57.02,18.29
  Top 0.406: R6.2 51.58,22.29 Q2.P$1 53.42,19.6 54.74,18.29 57.02,18.29 v58.29,19.56
  Bottom 0.406: v58.29,19.56 58.29,31.62 56.13,33.78 56.13,52.32 U$5.B30
RADIO_INT
  Top 0.406: U$8.GPIO0 17.78,12.06 18.41,12.7 18.41,19.68 17.78,20.32 10.79,20.32 9.53,19.05 5.46,19.05 | 5.46,19.05 5.08,19.05 J13.1 | 5.46,19.05 5.33,19.18 3.3,19.18 0.89,21.59 0.89,37.97 3.56,40.64 U$5.C54
RAIN  (via drill 0.36)
  Top 0.305: v40.77,61.98 40.77,49.02 38.86,47.12 27.05,47.12 25.53,45.59 25.53,42.29 26.04,41.78 28.96,41.78 29.21,42.04 U$5.C49
  Top 0.61: J2.2 81.28,89.24 R1.2 81.41,89.37 R16.2
  Bottom 0.305: J2.2 80.26,95.25 79.5,94.49 79.5,87.5 76.2,84.2 76.2,76.71 75.44,75.95 42.8,75.95 40.77,73.91 v40.77,61.98
RGND  (via drill 0.6)
  other vias: 11.3,2.67 47.24,2.67 48.51,33.66 10.79,37.47 41.02,10.29 17.14,18.8 26.04,37.47 33.66,37.47 18.41,33.66 26.04,33.66 33.66,33.66 45.09,33.66 22.23,22.23 29.84,22.23 37.47,22.23 22.23,18.41 29.84,18.41 37.47,18.41 22.23,14.61 29.84,14.61 37.47,14.61 22.23,10.79 29.84,10.79 22.23,6.99 29.84,6.99 37.47,6.99 22.23,3.17 29.84,3.17 37.47,3.17 44.96,27.05 48.51,27.05 44.96,25.02 42.93,33.66 42.93,27.05 42.93,25.02 10.79,30.61 10.79,28.07 10.79,25.53 18.41,30.61 18.41,28.07 18.41,25.53 26.04,30.61 26.04,28.07 26.04,25.53 33.66,30.61 33.66,28.07 33.66,25.53 18.36,37.47 10.79,33.66
  pour Top: 10.16,38.1 48.9,38.1 48.9,1.27 10.16,1.27
  pour Bottom: 10.16,38.1 48.9,38.1 48.9,1.27 10.16,1.27
RS232_RXD
  Top 0.305: IC1.13 75.13,18.85 75.95,18.03 75.95,15.62 75.44,15.11 73.91,15.11 73.41,14.61 73.41,8.76 74.17,8 76.45,8 77.09,7.37 J14.2
RS232_TXD
  Top 0.305: IC1.14 75.02,18.2 75.44,17.78 75.44,15.88 75.18,15.62 73.66,15.62 72.9,14.86 72.9,4.06 73.53,3.43 79.25,3.43 79.63,3.81 J14.3
RS485_N
  Top 0.305: 89.92,13.21 89.92,11.18 88.39,9.65 J10.2 | 89.92,13.21 U4.7 | R30.1 89.92,13.21
RS485_P  (via drill 0.36)
  Top 0.305: U4.6 88.65,13.21 | 88.65,13.21 v88.65,11.68 | R30.2 88.65,13.21
  Bottom 0.305: v88.65,11.68 88.65,11.43 90.93,9.14 J10.3
SCL  (via drill 0.3)
  Top 0.406: v2.16,40.64 3.81,42.29 3.81,54.86 4.7,55.75 30.99,55.75 31.88,54.86 35.81,54.86 36.58,55.63 36.58,60.2 v37.34,60.96
  Bottom 0.305: U3.16 35.05,58.04 36.7,59.69 37.47,59.69 55.88,59.69 U$5.B26
  Bottom 0.406: J11.3 3.56,9.02 2.16,10.41 v2.16,40.64 | v37.34,60.96 37.34,59.82 37.47,59.69
SDA  (via drill 0.3)
  Top 0.406: v1.52,41.91 2.92,43.31 2.92,56.13 3.17,56.39 31.5,56.39 v32,55.88
  Bottom 0.305: U3.15 33.27,56.77 33.66,56.39 35.18,56.39 36.07,57.28 55.75,57.28 U$5.B28
  Bottom 0.406: J11.2 2.92,6.48 1.14,8.26 1.14,41.53 v1.52,41.91 | v32,55.88 32.38,55.88 33.27,56.77
SENSE_3V3  (via drill 0.6)
  Top 0.305: U$6.2 64.12,13.98 63.63,14.48 63.63,20.54 R28.2 | R19.2 62.4,36.54 62.99,35.94 62.99,33.02 63.5,32.51 65.28,32.51 66.04,31.75 66.04,26.54 66.17,26.42
  Top 0.61: J11.4 4.83,11.43 3.05,11.43 2.29,10.67 2.29,2.54 3.56,1.27 97.16,1.27 98.17,2.29 98.17,22.73 97.28,23.62 86.11,23.62 84.07,25.53 84.07,30.17 Q4.P$4 83.36,30.18 VCC_S.TP | F2.1 F1.1 67.6,98.84 v67.94,99.19 | VCC_S.TP 80.9,32.89 86.11,38.1 95.76,38.1 v95.89,38.23 | VCC_S.TP 73.53,32.64 72.52,31.62 JP4.2 72.52,27.56 71.37,26.42 66.17,26.42 64.77,26.42 63.67,25.31 R28.2
  Bottom 0.61: v95.89,38.23 95.89,67.06 94.49,68.45 91.57,68.45 89.92,70.1 89.92,78.23 91.95,80.26 93.73,80.26 96.39,82.3 96.39,90.3 95.89,90.81 95.03,90.81 F7.1 F8.1 95.03,93.6 96.27,93.6 97.16,94.49 97.16,97.66 95.63,99.19 v67.94,99.19
SENSE_5V  (via drill 0.36, 0.6)
  Top 0.305: R22.2 71.21,74.33 v72.01,73.53 | v83.31,75.06 84.45,75.06
  Top 0.61: J11.5 4.83,14.22 2.29,14.22 1.27,13.21 1.27,2.03 2.79,0.51 97.54,0.51 99.31,2.29 v99.31,12.7 | v91.44,75.06 84.45,75.06 84.45,78.3 JP2.2
  Bottom 0.305: v72.01,73.53 72.52,73.03 81.28,73.03 v83.31,75.06
  Bottom 0.61: F4.2 F6.2 F5.2 93.56,12.7 v99.31,12.7 99.31,23.75 97.41,25.65 97.41,68.07 95.63,69.85 95.63,74.17 94.74,75.06 v91.44,75.06
SENSE_EN  (via drill 0.3, 0.36, 0.48, 0.6)
  Top 0.305: R10.2 63.84,60.11 v63.37,60.58 | v17.53,68.2 17.53,67.94 17.14,67.56 15.78,67.56 JP3.1 | v51.69,49.53 56.01,49.53 57.15,50.67 U$5.B32 57.78,50.8 58.55,51.56 v58.55,60.58 | 85.81,32.38 Q4.P$1 86.85,33.27 89.03,33.27 89.09,33.21 | R12.2 88.9,27.81 89.53,28.45 89.53,31.88 | 89.53,31.88 89.53,32.77 89.09,33.21 | R26.2 89.7,31.71 89.53,31.88 | v90.68,33.27 89.15,33.27 89.09,33.21
  Top 0.406: Q3.P$1 66.41,60.11 R10.2
  Bottom 0.305: v51.69,49.53 51.69,46.48 50.93,45.72 19.94,45.72 17.91,47.75 17.91,67.82 v17.53,68.2 | v58.55,60.58 v63.37,60.58
  Bottom 0.406: U$5.B32 58.55,52.2 60.58,52.2 62.1,50.67 85.34,50.67 86.87,49.15 86.87,33.91 87.5,33.27 v90.68,33.27
SPI_CLK  (via drill 0.48, 0.6)
  Top 0.406: U$8.SCLK 19.05,8.26 19.68,8.89 19.68,20.95 19.05,21.59 8.26,21.59 7.62,22.23 7.62,23.5 6.99,24.13 5.08,24.13 J13.3 | v40.51,35.94 56.01,35.94 59.82,39.75 59.82,47.24 58.8,48.26 U$5.B34 | v38.73,24.26 v10.03,24.26
  Bottom 0.406: v38.73,24.26 39.88,25.4 39.88,35.31 v40.51,35.94 | v10.03,24.26 J13.3
SPI_SIMO  (via drill 0.48)
  Top 0.406: U$8.MOSI 19.68,6.99 20.32,7.62 20.32,21.59 19.68,22.23 8.89,22.23 8.26,22.86 8.26,23.81 6.99,25.08 6.99,26.48 6.67,26.8 J13.4 | v37.34,36.96 55.88,36.96 58.67,39.75 58.67,44.2 U$5.B36 | v36.83,26.8 v9.02,26.8
  Bottom 0.406: v36.83,26.8 36.96,26.92 36.96,36.58 v37.34,36.96 | v9.02,26.8 J13.4
SPI_SOMI  (via drill 0.48)
  Top 0.406: U$8.MISO 20.32,5.71 20.95,6.35 20.95,22.23 20.32,22.86 9.21,22.86 8.89,23.18 8.89,24.13 7.62,25.4 7.62,28.83 7.11,29.34 | 7.11,29.34 J13.5 | 7.11,29.34 37.72,29.34 v38.48,30.1 | v39.37,38.86 56.26,38.86 57.15,39.75 U$5.B40
  Bottom 0.406: v38.48,30.1 38.48,37.97 v39.37,38.86
TTL_RX  (via drill 0.6)
  Top 0.305: v64.9,15.24 67.27,15.24 U$6.4
  Bottom 0.305: J12.2 65.91,8.26 65.28,8.89 65.28,14.86 v64.9,15.24
TTL_TX  (via drill 0.6)
  Top 0.305: U$6.7 66.13,17.23 v65.79,16.89
  Bottom 0.305: v65.79,16.89 65.79,9.14 66.42,8.51 67.82,8.51 68.45,7.87 J12.3
TXEN  (via drill 0.36)
  Top 0.305: R31.2 95.76,14.73 95.5,14.99 94.23,14.99 v93.98,15.24 | v93.47,21.84 90.42,21.84 89.92,21.34 U4.2 U4.3 88.65,21.59 88.14,22.1 85.85,22.1 82.04,25.91 77.22,25.91 v76.45,26.67 | v57.91,35.31 50.55,35.31 v50.29,35.05 | v49.53,39.88 48.77,39.88 48.51,39.62 35.31,39.62 U$5.C46
  Bottom 0.305: v93.98,15.24 93.98,21.34 v93.47,21.84 | v76.45,26.67 76.45,32.51 75.18,33.78 59.44,33.78 v57.91,35.31 | v50.29,35.05 50.04,35.31 50.04,39.37 v49.53,39.88
UART1_RX  (via drill 0.36)
  Top 0.305: U$6.20 62.61,13.33 62.74,13.46 62.74,14.48 62.61,14.61 61.5,14.61 U$6.18 U$6.17 60.54,15.28 59.44,16.38 59.44,31.5 57.78,33.15 53.34,33.15 v52.58,33.91
  Bottom 0.305: v52.58,33.91 52.58,48.77 U$5.B31
UART1_TX  (via drill 0.36)
  Top 0.305: U$6.16 U$6.15 U$6.14 60.37,17.23 59.94,17.65 59.94,31.75 57.91,33.78 54.1,33.78 v53.47,34.42
  Bottom 0.305: v53.47,34.42 53.47,47.12 U$5.B33
USB_D_N
  Top 0.305: U$5.B21 56.11,64.9 56.11,72.74 54.07,74.65 13.94,74.65 13.59,75 13.59,83.44 12.59,84.44 X1.2
USB_D_P
  Top 0.305: U$5.B19 55.65,67.31 55.65,72.42 53.75,74.19 13.75,74.19 13.08,74.86 13.08,83.06 12.83,83.31 8.64,83.31 8.07,83.88 X1.3
USB_GND
  Top 0.406: X1.4 7,81.94 5.71,80.64 5.71,75.25 7.3,73.66 53.34,73.66 54.61,72.39 U$5.B17
USB_VCC  (via drill 0.36, 0.6)
  Top 0.406: X1.1 11.27,75.72 v12.38,74.61 | v12.38,69.85 22.86,69.85 U$5.A3
  Bottom 0.406: v12.38,74.61 v12.38,69.85
VBAT_B  (via drill 0.6)
  Top 0.305: U$3.V+@2 63.75,89.35 | U$3.V+@1 36.37,89.33 v35.56,88.52
  Top 0.406: U$3.V+@1 36.47,89.41 v36.45,89.41
  Top 0.61: BATV_B.TP 34.92,89.15 v35.56,88.52
  Bottom 0.305: v35.56,88.52 35.56,61.98 35.31,61.72 32.89,61.72 32,60.83 U3.14
  Bottom 0.61: v36.45,89.41 40.77,93.73 58.63,93.73 U$3.V+@2
  other vias: 63.01,89.35
VCC
  Top 0.305: VCC.TP 62.1,78.23 58.86,74.99 | R17.2 63.41,74.59 61.34,72.52
  Top 0.406: Q3.P$2 67.69,59.62 67.69,58.55 67.09,57.95 R11.2
  Top 0.61: C1.1 63.46,40.01 64.01,40.01 64.64,40.64 67.56,40.64 | 67.56,40.64 67.94,40.64 68.45,41.15 U1.5 | U1.4 67.56,41.91 67.56,40.64
  Top 1.27: D1.C 15.88,93.66 22.35,86.36 22.35,84.9 C3.+ 24.19,85.34 26.04,85.34 27.56,83.82 27.56,78.61 30.1,76.07 57.78,76.07 58.86,74.99 61.34,72.52 61.34,57.78 | 67.09,57.95 66.93,57.78 | C1.1 61.56,39.66 61.34,39.88 61.34,57.78 | 61.34,57.78 67.09,57.78 R11.2
VCC_3V3  (via drill 0.36, 0.6)
  Top 0.305: Q4.P$2 85.09,32.38 85.09,31.5 86.74,31.5 87.12,31.88 87.97,31.88 R13.2 | U$6.19 53.2,13.98 v52.45,14.73 | v62.74,71.25 64.01,72.52 73.28,72.52 74.42,73.66 R18.2 77.13,74.46 77.34,74.68 v77.34,80.52 | v58.67,70.74 58.67,63.5 | v43.69,46.35 43.69,41.4 42.93,40.64 U$5.C40
  Top 0.406: Q2.P$2 54.37,21.61 R7.2 55.03,19.3 v55.12,19.3
  Top 0.61: U$5.B22 58.67,63.5 59.82,62.36 v59.82,53.98 | Q4.P$2 85.09,32.46 85.09,33.4 86.11,34.42 96.77,34.42 97.61,35.25 JP1.1 98.81,41.27 99.19,41.66 99.19,51.31 97.54,52.96 84.96,52.96 82.8,50.8 66.04,50.8 v63.25,53.59
  Bottom 0.305: C19.2 30.7,52.74 33.4,50.04 33.4,48.77 U3.2 33.27,47.24 34.04,46.48 43.56,46.48 v43.69,46.35 | v52.45,14.73 52.45,20.7 52.7,20.95 | v62.74,71.25 59.18,71.25 v58.67,70.74 | v77.34,80.52 77.34,84.33 78.49,85.47 83.31,85.47 83.82,85.98 F3.2
  Bottom 0.406: U$5.C40 41.91,22.86 43.81,20.95 52.7,20.95 53.47,20.95 v55.12,19.3
  Bottom 0.61: v63.25,53.59 60.2,53.59 v59.82,53.98 59.18,54.61 44.7,54.61 43.69,53.59 v43.69,46.35
VCC_HP2_SW
  Top 0.61: U2.5 U2.4 71.95,64.05 C12.1 69.72,62.9 Q3.P$4
VCC_HP2_SW1  (via drill 0.6)
  Top 0.305: Q1.P$4 6.68,65.87 v7.24,66.42 | v8.51,58.55 14.73,58.55 14.57,58.76 14.57,58.8 R8.2
  Bottom 0.305: v7.24,66.42 7.24,59.82 v8.51,58.55

### Text on the board
tNames: MS1 | V0.2 | 485 | 232 | PJB | TW | GMB